# Altium project ResEnvAudioBoard.PrjPcb
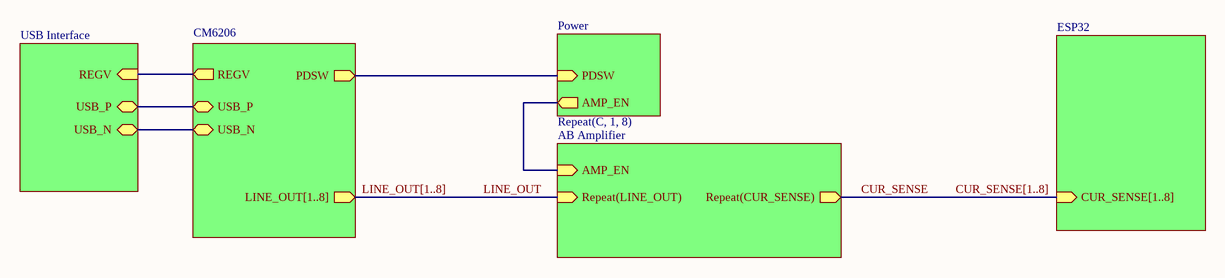
[diagram p0: Top Level.SchDoc]
6 sheets, 193 parts. Net scope: hierarchical (ports join the sheet entries above them; power ports are global).
Board file: AudioPCB.PcbDoc
Sheets:
  Top Level.SchDoc
    USB = USB Interface.SchDoc
    CM6206 = CM6206.SchDoc
    Power = Power.SchDoc
    C1 = AB Amplifier.SchDoc
    C2 = AB Amplifier.SchDoc
    C3 = AB Amplifier.SchDoc
    C4 = AB Amplifier.SchDoc
    C5 = AB Amplifier.SchDoc
    C6 = AB Amplifier.SchDoc
    C7 = AB Amplifier.SchDoc
    C8 = AB Amplifier.SchDoc
    Designator = ESP32.SchDoc

## Sheet Top Level.SchDoc
size 431 x 279 mm; Organization: ORGANIZATION; Address1: ADDRESS 1; Address2: ADDRESS 2; Address3: ADDRESS 3; Address4: ADDRESS 4; Revision: -; SheetNumber: 1; SheetTotal: 5; ENG_APP_DATE: --/--/--; DSN_APP_DATE: --/--/--; CHK_APP_DATE: --/--/--

### Sub-sheets
CM6206 = CM6206: PDSW (out), USB_P (bidir), USB_N (bidir), REGV (out), LINE_OUT[1..8] (out)
Designator = ESP32: CUR_SENSE[1..8] (in)
Power = Power: PDSW (in), AMP_EN (out)
Repeat(C, 1, 8) = AB Amplifier: Repeat(LINE_OUT) (in), Repeat(CUR_SENSE) (out), AMP_EN (in)
USB = USB Interface: USB_N (bidir), USB_P (bidir), REGV (in)

### Nets
AMP_EN: sheet Power/AMP_EN, sheet Repeat(C, 1, 8)/AMP_EN
CUR_SENSE: sheet Repeat(C, 1, 8)/Repeat(CUR_SENSE)
LINE_OUT: sheet Repeat(C, 1, 8)/Repeat(LINE_OUT)
USB_N: sheet USB/USB_N, sheet CM6206/USB_N
USB_P: sheet USB/USB_P, sheet CM6206/USB_P
NetC19_2: sheet USB/REGV, sheet CM6206/REGV
NetQ1_1: sheet CM6206/PDSW, sheet Power/PDSW

### Buses and harness runs
bus CUR_SENSE[1..8] = sheet Designator/CUR_SENSE[1..8]
bus LINE_OUT[1..8] = sheet CM6206/LINE_OUT[1..8]

### Notes on the sheet
- DWG. NO.
- REV.
- SHT.
- THIS DOCUMENT AND THE DATA DISCLOSED HEREIN OR HEREWITH IS THE PROPERTY OF ALTIUM LIMITED AND MAY BE FREELY DISTRIBUTED IN WHOLE. NO RIGHTS ARE RESERVED OR EXPRESS OR IMPLIED WARANTEE GIVEN.
- REVISION
- DESCRIPTION
- DATE
- APPROVED
- ENG:
- APPROVALS
- PROJECT
- DSN:
- CHK:
- REFERENCE DOCUMENTS
- PROJECT REVISION:
- TITLE
- DOCUMENT REVISION:
- DESIGN ITEM:
- BOM:
- FAB DWG:
- PCB DWG:
- ASSY DWG:
- SCALE:
- SIZE
- B
- CAGE CODE
- FILE NAME
- DWG NO.
- SHEET
- OF
- REV

## Sheet USB Interface.SchDoc
size 431 x 279 mm; Organization: ORGANIZATION; Address1: ADDRESS 1; Address2: ADDRESS 2; Address3: ADDRESS 3; Address4: ADDRESS 4; Revision: -; SheetNumber: 4; SheetTotal: 6; ENG_APP_DATE: --/--/--; DSN_APP_DATE: --/--/--; CHK_APP_DATE: --/--/--
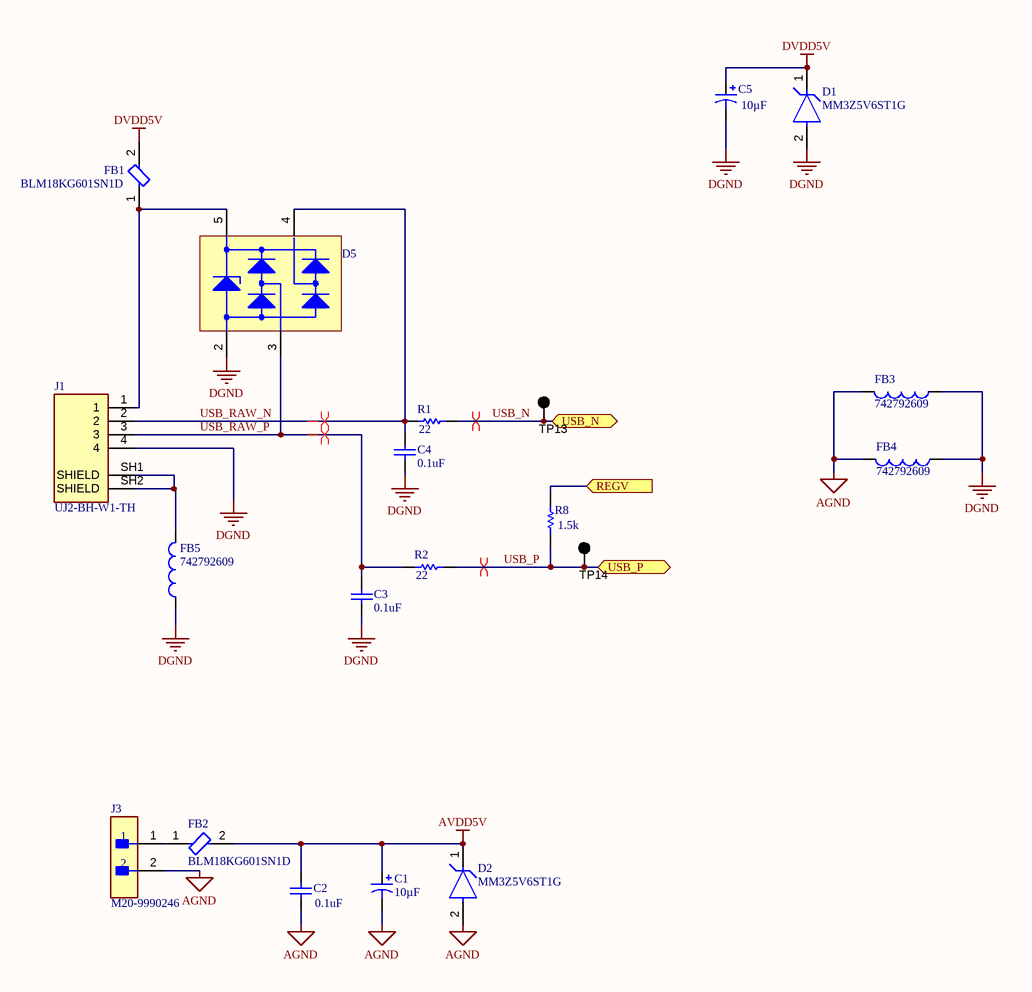
[diagram p1: USB Interface.SchDoc]

### Parts
C1  10µF  [1206 TANT CASE A]
C2  0.1uF  [0603]
C3  0.1uF  [0603]
C4  0.1uF  [0603]
C5  10µF  [1206 TANT CASE A]
D1  MM3Z5V6ST1G  [FP-477-02-MFG]
D2  MM3Z5V6ST1G  [FP-477-02-MFG]
D5  5V  [WE-TVS_SOT23-5L]  (value not drawn)
FB1  BLM18KG601SN1D  [FP-BLM18-0_15-t0_8-IPC_A]
FB2  BLM18KG601SN1D  [FP-BLM18-0_15-t0_8-IPC_A]
FB3  742792609  [WE-CBF_0603_L1.6W0.8H0.8_HC]
FB4  742792609  [WE-CBF_0603_L1.6W0.8H0.8_HC]
FB5  742792609  [WE-CBF_0603_L1.6W0.8H0.8_HC]
J1  UJ2-BH-W1-TH  [CUI_UJ2-BH-W1-TH]
J3  M20-9990246  [FP-M20-9990246-MFG]
R1  22  [0603]
R2  22  [0603]
R8  1.5k  [0603]
TP13  5001  [Testpoint pad]  (value not drawn)
TP14  5001  [Testpoint pad]  (value not drawn)

### Ports
REGV (in, see Top Level[7E], CM6206[7D]), USB_N (bidir, see Top Level[7E], CM6206[7D]), USB_P (bidir, see Top Level[7E], CM6206[7D])

### Nets
AGND: C1.1 C2.1 D2.2(A) FB3.2 FB4.2 J3.2
AVDD5V: C1.2 C2.2 D2.1(C) FB2.2
DGND: C3.1 C4.1 C5.1 D1.2(A) D5.2(GND) FB3.1 FB4.1 FB5.1 J1.4
DVDD5V: C5.2 D1.1(C) FB1.2
USB_N: R1.2 TP13.1 ; port USB_N
USB_P: R2.2 R8.2 TP14.1 ; port USB_P
USB_RAW_N: C4.2 D5.4(I/O_2) J1.2 R1.1
USB_RAW_P: C3.2 D5.3(I/O_1) J1.3 R2.1
NetC19_2: R8.1 ; port REGV
NetD5_5: D5.5(VDD) FB1.1 J1.1
NetFB2_1: FB2.1 J3.1
NetFB5_2: FB5.2 J1.SH1(SHIELD) J1.SH2(SHIELD)

### Layout directives
differential pair: USB_N, USB_P, USB_RAW_N, USB_RAW_P

### Notes on the sheet
- DWG. NO.
- REV.
- SHT.
- THIS DOCUMENT AND THE DATA DISCLOSED HEREIN OR HEREWITH IS THE PROPERTY OF ALTIUM LIMITED AND MAY BE FREELY DISTRIBUTED IN WHOLE. NO RIGHTS ARE RESERVED OR EXPRESS OR IMPLIED WARANTEE GIVEN.
- REVISION
- DESCRIPTION
- DATE
- APPROVED
- ENG:
- APPROVALS
- PROJECT
- DSN:
- CHK:
- REFERENCE DOCUMENTS
- PROJECT REVISION:
- TITLE
- DOCUMENT REVISION:
- DESIGN ITEM:
- BOM:
- FAB DWG:
- PCB DWG:
- ASSY DWG:
- SCALE:
- SIZE
- B
- CAGE CODE
- FILE NAME
- DWG NO.
- SHEET
- OF
- REV

### Library data of the parts
C1 C5 = T491A106M016AT: CAP TANT 10UF 16V 20% 1206; Manufacturer Size Code: A; Manufacturer: Kemet; ESR (Equivalent Series Resistance): 7 Ohm; Type: Molded; Lifetime @ Temp.: 2000 Hrs @ 85°C; Packaging: Cut Tape (CT); Capacitance: 10µF; Tolerance: ±20%; Voltage - Rated: 16V; Operating Temperature: -55°C ~ 125°C; Mounting Type: Surface Mount; Package / Case: 1206 (3216 Metric); Size / Dimension: 0.126" L x 0.063" W (3.20mm x 1.60mm); Height - Seated (Max): 0.071" (1.80mm); Lead Spacing: -; Features: General Purpose; ComponentLink1URL: http://www.kemet.com/Lists/ProductCatalog/Attachments/254/KEM_T2005_T491.pdf; ComponentLink1Description: http://www.kemet.com/Lists/ProductCatalog/Attachments/254/KEM_T2005_T491.pdf; Supplier 1: Digi-Key; Supplier Part Number 1: 399-3687-1-ND; Manufacturer Part Number: T491A106M016AT; RoHS: RoHS Compliant; Category: Capacitors; Stock: 136950; Pricing: 1=0.41, 10=0.362, 50=0.2198, 100=0.181, 250=0.14476, 500=0.13184, 1000=0.11891 (USD)
C2-C4 = C TBD 0603
D1 D2 = CMP-1060-00706-2: DIODE ZENER 5.6V 300MW SOD323; Test Current: 5mA; Power Rating: 200mW; ESD Protection: Yes; Peak Reverse Current: 1uA; Voltage Tolerance: 2%; Forward Voltage: 900mV; Impedance: 40R; Element Configuration: Single; Material: Plastic; Zener Current: 10mA; Length: 1.8mm; Package Quantity: 1; Contact Plating: Tin; Number of Pins: 2; Case/Package: SOD-323-2; Max Power Dissipation: 200mW; Lead Free: Lead Free; Radiation Hardening: No; Width: 1.35mm; REACH SVHC: No SVHC; Zener Voltage: 5.6V; Height: 1mm; Max Reverse Leakage Current: 1uA; Packaging: Tape and Reel; Min Operating Temperature: -65°C; Voltage Rating (DC): 5.6V; Power Dissipation: 200mW; Max Operating Temperature: 150°C; Working Voltage: 5.6V; Tolerance: 2%
D5 = 824011: WE-TVS TVS Diode – High Speed Series, SOT23-5L, 2+1 Channel, 5V, 2pF; Manufacturer: Wurth Elektronik; Channel ESD Clamping Voltage: 13V; Channel Reverse Leakage Current: 1uA; ESD Air Discharge Capability: 24kV; ESD Contact Discharge Capability: 16kV; Polarity: Unidirectional; (Reverse) Breakdown Voltage: 6.1V; (Reverse) Peak Pulse Current: 13A; Manufacturer Part Number: 824011; Category: ESD Protection; Match Code: WE-TVS; ComponentLink1Description: Website Link; ComponentLink1URL: https://www.we-online.com/redexpert/article/824011?ad; ComponentLink2Description: Datasheet Link; ComponentLink2URL: https://www.we-online.com/redexpert/spec/824011?ad; Mount: Surface Mount; Operating Temperature Max: 125°C; Operating Temperature Min: -55°C; Packaging: Tape and Reel; Case/Size Code: SOT23-5L; Length: 2.9mm; Width: 2.8mm; Height: 1.16mm; Channel Input Capacitance: 2pF; Channel Operating Voltage: 5V; Number of Channels: 2+1
FB1 FB2 = CMP-0686-00581-3: Chip Ferrite Bead, 0603, 600Ω @ 100MHz, 0.15Ω, 25%, 1.3A; Material: Steel; Number of Lines: 1; Impedance: 600R; DC Resistance (DCR): 150mR; Tolerance: 25%; Case Code (Metric): 1608; Width: 0.8mm; DC Current: 1.3A; Max DC Current: 1.3A; Package Quantity: 1; Number of Pins: 2; Military Standard: Not; RoHS Compliant: Yes; Termination: SMD/SMT; Max Operating Temperature: 125°C; Length: 1.6mm; Depth: 0.8mm; Case Code (Imperial): 0603; Series: BLM18K; Inductor Type: FERRITE BEAD; Core Material: Ferrite; Number of Circuits: 1; Height: 0.8mm; Case/Package: 0603; REACH SVHC: No SVHC; Packaging: Tape and Reel; Min Operating Temperature: -55°C; Max Current Rating: 1.3A; Radiation Hardening: No; Current Rating: 1.3A; Lead Free: Lead Free; Test Frequency: 100MHz; Weight: 7.1E-05oz
FB3-FB5 = CMP-0220-00193-3: NexarPartId: 8916973; Series Resistance: 40mΩ; RMS Current (Irms): 3A; Number of Lines: 1; Tolerance: 25%; Inductance: 5.6H; Test Frequency: 100MHz; Impedance: 30Ω; Max Operating Temperature: 125°C; Termination: SMD/SMT; Length: 1.6mm; Mount: Surface Mount; Case/Package: SMD/SMT; REACH SVHC: Unknown; Max DC Current: 3A; DC Resistance (DCR): 40mΩ; Resistance: 40mΩ; Min Operating Temperature: -55°C; Max Current Rating: 3A; Case Code (Metric): 1608; Width: 800µm; Material: Ferrite; Current Rating: 3A; Core Material: Ferrite; Packaging: Digi-Reel®; Height: 800µm; RoHS: Compliant; Depth: 800µm; Weight: 3.997283mg; Case Code (Imperial): 0603
J1 = UJ2-BH-W1-TH: 3 µin Plating Thickness, White Insulator, USB Receptacle; MF: {'manufacturer': u'CUI'}; Price: None; Value: *; Package: None; Availability: Unavailable; MP: UJ2-BH-W1-TH
J3 = CMP-15831-000009-1: CONN HEADER VERT 2POS 2.54MM; Manufacturer: Harwin; Conn Gender: Male; Conn Orientation: Vertical; Number Of Contacts: 2; Current Rating: 3A; ComponentLink2URL: https://cdn.harwin.com/pdfs/M20-999.pdf; ComponentLink2Description: Datasheet; Package: M20-9990246; Temperature: -40°C to +105°C; Octopart: https://octopart.com/m20-9990246-harwin-2590635; Mouser Description: 2.54mm (0.1") Pitch SIL Vertical PC Tail Pin Header, 6.1mm mating pin height, tin, 2 contacts; Temperature Range High: +105°C; Device Class L1: Connectors; RoHS: TRUE; Automotive: No; Height: 8.99mm; Number Of Rows: 1; Contact Material: Tin,Nickel; Category: Conn; Pitch: 2.54mm; Lead Free: Yes; Digikey Description: CONN HEADER VERT 2POS 2.54MM; Manufacturer Part Number: M20-9990246; Temperature Range Low: -40°C; Device Class L3: unset; Device Class L2: Headers and Wire Housings
R1 R2 R8 = R TBD 0603
TP13 TP14 = 5001: TEST POINT PC MINI .040"D BLACK; Manufacturer: Keystone Electronics; Packaging: Bulk; Type: PC Test Point, Miniature; Terminal: 0.010" x 0.020" (0.25mm x 0.51mm) Phosphor Bronze Wire, Silver Plated; Mounting Type: 0.040" (1.02mm) Hole Diameter; Material: Base, Nylon 46, UL 94V-0; Color: Black; ComponentLink1URL: http://www.keyelco.com/product-pdf.cfm?p=1310; ComponentLink1Description: http://www.keyelco.com/product-pdf.cfm?p=1310; Supplier 1: Digi-Key; Supplier Part Number 1: 36-5001-ND; Manufacturer Part Number: 5001; RoHS: RoHS Compliant; Category: Test and Measurement; Stock: 443864; Pricing: 1=0.36, 10=0.327, 50=0.238, 100=0.2286, 250=0.20528, 500=0.19594, 1000=0.16328, 2500=0.14928, 5000=0.13995 (USD)

## Sheet CM6206.SchDoc
size 431 x 279 mm; Organization: ORGANIZATION; Address1: ADDRESS 1; Address2: ADDRESS 2; Address3: ADDRESS 3; Address4: ADDRESS 4; Revision: -; SheetNumber: 3; SheetTotal: 6; ENG_APP_DATE: --/--/--; DSN_APP_DATE: --/--/--; CHK_APP_DATE: --/--/--
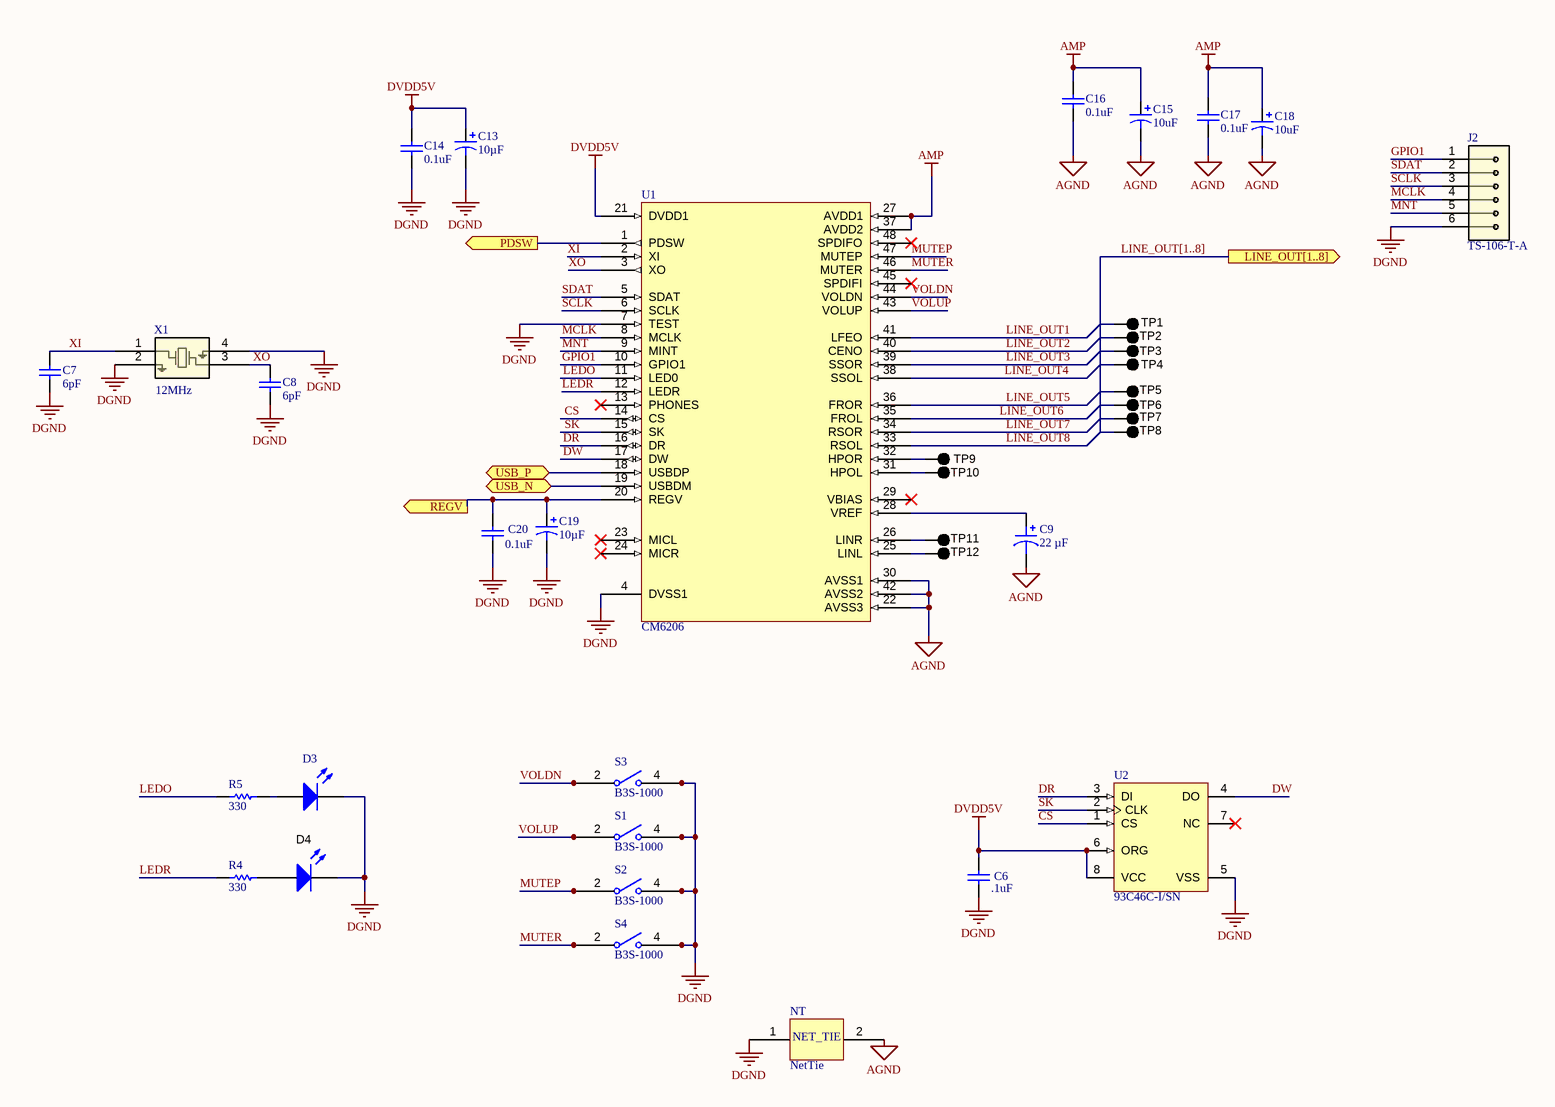
[diagram p2: CM6206.SchDoc]

### Parts
C6  .1uF  [0603]
C7  6pF  [0603]
C8  6pF  [0603]
C9  22 µF  [CAP POL 1411_3528]
C13  10µF  [1206 TANT CASE A]
C14  0.1uF  [0603]
C15  10uF  [1206 TANT CASE A]
C16  0.1uF  [0603]
C17  0.1uF  [0603]
C18  10uF  [1206 TANT CASE A]
C19  10µF  [1206 TANT CASE A]
C20  0.1uF  [0603]
D3  LTST-C190KGKT  [LED_LTST-C190]  (value not drawn)
D4  LB Q39G-L2OO-35-1  [LB Q39G_BLUE]  (value not drawn)
J2  TS-106-T-A  [CON6_1X6_TU_HTS_SAI]
NT  NetTie  [NetTie]  (net tie, no BOM)
R4  330  [0603]
R5  330  [0603]
S1  B3S-1000  [B3S-1000_OMR]
S2  B3S-1000  [B3S-1000_OMR]
S3  B3S-1000  [B3S-1000_OMR]
S4  B3S-1000  [B3S-1000_OMR]
TP1  5001  [Testpoint pad]  (value not drawn)
TP2  5001  [Testpoint pad]  (value not drawn)
TP3  5001  [Testpoint pad]  (value not drawn)
TP4  5001  [Testpoint pad]  (value not drawn)
TP5  5001  [Testpoint pad]  (value not drawn)
TP6  5001  [Testpoint pad]  (value not drawn)
TP7  5001  [Testpoint pad]  (value not drawn)
TP8  5001  [Testpoint pad]  (value not drawn)
TP9  5001  [Testpoint pad]  (value not drawn)
TP10  5001  [Testpoint pad]  (value not drawn)
TP11  5001  [Testpoint pad]  (value not drawn)
TP12  5001  [Testpoint pad]  (value not drawn)
U1  CM6206  [CM6206 LQFP48]
U2  93C46C-I/SN  [SOIC-SN8_N]
X1  ECS-120-8-36-CKM-TR3  [ECS-120-8_ECS]  (value not drawn)

### Ports
LINE_OUT[1..8] (out, see Top Level[6D]), PDSW (out, see Top Level[6E], Power[7E]), REGV (out, see Top Level[6E], USB Interface[5D]), USB_N (bidir, see Top Level[6E], USB Interface[5D]), USB_P (bidir, see Top Level[6E], USB Interface[5D])

### Nets
AGND: C9.2 C15.1 C16.1 C17.1 C18.1 NT.2 U1.22(AVSS3) U1.30(AVSS1) U1.42(AVSS2)
AMP: C15.2 C16.2 C17.2 C18.2 U1.27(AVDD1) U1.37(AVDD2)
DGND: C6.1 C7.1 C8.1 C13.1 C14.1 C19.1 C20.1 D3.2(K) D4.2(K) J2.6 NT.1 S1.3 S1.4 S2.3 S2.4 S3.3 S3.4 S4.3 S4.4 U1.4(DVSS1) U1.7(TEST) U2.5(VSS) X1.2 X1.4
DVDD5V: C6.2 C13.2 C14.2 U1.21(DVDD1) U2.6(ORG) U2.8(VCC)
CS: U1.14(CS) U2.1(CS)
DR: U1.16(DR) U2.3(DI)
DW: U1.17(DW) U2.4(DO)
GPIO1: J2.1 U1.10(GPIO1)
LEDO: R5.2 U1.11(LED0)
LEDR: R4.2 U1.12(LEDR)
LINE_OUT1: TP1.1 U1.41(LFEO)
LINE_OUT2: TP2.1 U1.40(CENO)
LINE_OUT3: TP3.1 U1.39(SSOR)
LINE_OUT4: TP4.1 U1.38(SSOL)
LINE_OUT5: TP5.1 U1.36(FROR)
LINE_OUT6: TP6.1 U1.35(FROL)
LINE_OUT7: TP7.1 U1.34(RSOR)
LINE_OUT8: TP8.1 U1.33(RSOL)
MCLK: J2.4 U1.8(MCLK)
MNT: J2.5 U1.9(MINT)
MUTEP: S2.1 S2.2 U1.47(MUTEP)
MUTER: S4.1 S4.2 U1.46(MUTER)
SCLK: J2.3 U1.6(SCLK)
SDAT: J2.2 U1.5(SDAT)
SK: U1.15(SK) U2.2(CLK)
USB_N: U1.19(USBDM) ; port USB_N
USB_P: U1.18(USBDP) ; port USB_P
VOLDN: S3.1 S3.2 U1.44(VOLDN)
VOLUP: S1.1 S1.2 U1.43(VOLUP)
XI: C7.2 U1.2(XI) X1.1
XO: C8.2 U1.3(XO) X1.3
NetC9_1: C9.1 U1.28(VREF)
NetC19_2: C19.2 C20.2 U1.20(REGV) ; port REGV
NetD3_1: D3.1(A) R5.1
NetD4_1: D4.1(A) R4.1
NetQ1_1: U1.1(PDSW) ; port PDSW
NetTP9_1: TP9.1 U1.32(HPOR)
NetTP10_1: TP10.1 U1.31(HPOL)
NetTP11_1: TP11.1 U1.26(LINR)
NetTP12_1: TP12.1 U1.25(LINL)

Not connected (* = marked no-connect by the designer): U1 13(PHONES)* 23(MICL)* 24(MICR)* 29(VBIAS)* 45(SPDIFI)* 48(SPDIFO)*; U2 7(NC)*

### Buses and harness runs
bus LINE_OUT[1..8] = port LINE_OUT[1..8]

### Notes on the sheet
- (near X1) 12MHz
- DWG. NO.
- REV.
- SHT.
- THIS DOCUMENT AND THE DATA DISCLOSED HEREIN OR HEREWITH IS THE PROPERTY OF ALTIUM LIMITED AND MAY BE FREELY DISTRIBUTED IN WHOLE. NO RIGHTS ARE RESERVED OR EXPRESS OR IMPLIED WARANTEE GIVEN.
- REVISION
- DESCRIPTION
- DATE
- APPROVED
- ENG:
- APPROVALS
- PROJECT
- DSN:
- CHK:
- REFERENCE DOCUMENTS
- PROJECT REVISION:
- TITLE
- DOCUMENT REVISION:
- DESIGN ITEM:
- BOM:
- FAB DWG:
- PCB DWG:
- ASSY DWG:
- SCALE:
- SIZE
- B
- CAGE CODE
- FILE NAME
- DWG NO.
- SHEET
- OF
- REV
- (in symbol NetTie) NET_TIE

### Library data of the parts
C6-C8 C14 C16 C17 C20 = C TBD 0603
C9 = T495B226K010ATE500: CAP TANT 22UF 10% 10V 1411; manufacturer: KEMET; Manufacturer Size Code: B; ESR (Equivalent Series Resistance): 500mOhm @ 100kHz; Lifetime @ Temp.: 2000 Hrs @ 125°C; Type: Molded; Part Number: T495B226K010ATE500; Value: 22 µF; Capacitance: 22 µF; componentlink1description: Datasheet; componentlink1url: https://api.kemet.com/component-edge/download/datasheet/T495B226K010ATE500.pdf; componentlink2description: DigiKey Link; componentlink2url: https://www.digikey.com/en/products/detail/kemet/T495B226K010ATE500/8763592; Device Package: 1411 (3528 Metric); Features: General Purpose; Height - Seated (Max): 0.083" (2.10mm); lastupdated: 6/3/2024 7:29:03 PM; Lifecycle Status: Active; Minimum Order: 1; Mounting Type: Surface Mount; Operating Temperature: -55°C ~ 125°C; Package / Case: 1411 (3528 Metric); packaging: TapeAndReel; partid: 6; Part Status: Active; price: 0.50; series: T495; Size / Dimension: 0.138" L x 0.110" W (3.50mm x 2.80mm); Supplier 1: DigiKey; Supplier Part Number 1: 399-18339-1-ND; Tolerance: ±10%; Voltage - Rated: 10 V
C13 C15 C18 C19 = T491A106M016AT: as C1 on sheet USB Interface; Packaging: Cut Tape (CT); Tolerance: ±20%; Voltage - Rated: 16V; Operating Temperature: -55°C ~ 125°C; Mounting Type: Surface Mount; Package / Case: 1206 (3216 Metric); Size / Dimension: 0.126" L x 0.063" W (3.20mm x 1.60mm); Height - Seated (Max): 0.071" (1.80mm); Lead Spacing: -; Features: General Purpose; ComponentLink1URL: http://www.kemet.com/Lists/ProductCatalog/Attachments/254/KEM_T2005_T491.pdf; ComponentLink1Description: http://www.kemet.com/Lists/ProductCatalog/Attachments/254/KEM_T2005_T491.pdf; Supplier 1: Digi-Key; Supplier Part Number 1: 399-3687-1-ND; Manufacturer Part Number: T491A106M016AT; RoHS: RoHS Compliant; Category: Capacitors; Stock: 136950; Pricing: 1=0.41, 10=0.362, 50=0.2198, 100=0.181, 250=0.14476, 500=0.13184, 1000=0.11891 (USD)
  C13 C19: Capacitance: 10µF
  C15 C18: Capacitance: 10uF
D3 = LTST-C190KGKT: LED GREEN CLEAR 0603 SMD; Manufacturer: Lite-On Inc.; Wavelength - Dominant: 571nm; Wavelength - Peak: 574nm; Millicandela Rating: 35mcd; Voltage - Forward (Vf) (Typ): 2V; Current - Test: 20mA; Viewing Angle: 130°; Lens Color: Colorless; Lens Style/Size: Rectangle with Flat Top, 1.10mm x 0.80mm; Packaging: Cut Tape (CT); Color: Green; Lens Transparency: Clear; Package / Case: 0603 (1608 Metric); Supplier Device Package: *; Size / Dimension: 1.60mm L x 0.80mm W; Height (Max): 0.80mm; Mounting Type: Surface Mount; ComponentLink1URL: http://optoelectronics.liteon.com/upload/download/DS22-2000-074/S_110_LTST-C190KGKT.pdf; ComponentLink1Description: http://optoelectronics.liteon.com/upload/download/DS22-2000-074/S_110_LTST-C190KGKT.pdf; Supplier 1: Digi-Key; Supplier Part Number 1: 160-1435-1-ND; Manufacturer Part Number: LTST-C190KGKT; RoHS: RoHS Compliant; Category: Optoelectronics; Stock: 632012; Pricing: 1=0.24, 10=0.186, 100=0.1015, 250=0.06768, 500=0.05752, 1000=0.04399 (USD); Supplier 2: Mouser; Supplier Part Number 2: 859-LTST-C190KGKT
D4 = LB Q39G-L2N2-35-1: LED BLUE DIFFUSED 0603 SMD; Manufacturer: OSRAM; Vf_V: 2.85; Value2: 2.85V; Io_A: 0.15; Tjmax_C: 95; Value1: W; U/M: EA; Wavelength - Dominant: 470nm; Wavelength - Peak: 472nm; Millicandela Rating: 29.5mcd; Current - Test: 5mA; Viewing Angle: 155°, 135°; Lens Color: White; Lens Style/Size: Rectangle with Flat Top, 1.10mm x 0.80mm; CompType: LED; PartNumber: LB Q39G-L2N2-35-1; SymbolVersion: 2008-12-08; MountType: SMT; RoHS: Y; PackageReference: BLUE 0603 LED; Type: ?; Published: 2008-07-11; Publisher: Texas Instruments; ComponentLink1URL: http://catalog.osram-os.com/catalogue/catalogue.do;jsessionid=8F4D5D14036503CDC6D844D9AC77EBC1?act=downloadFile&favOid=02000006000372cb000100b6; ComponentLink1Description: Datasheet link; LatestRevisionDate: 2015-04-28; Supplier 1: Digi-Key; Supplier Part Number 1: 475-2816-1-ND; Supplier 2: Mouser; Supplier Part Number 2: 720-LBQ39GL2N2351; Packaging: Cut Tape (CT); Voltage - Forward (Vf) (Typ): 2.85V; Lens Transparency: Diffused; Package / Case: 0603 (1608 Metric); Supplier Device Package: *; Size / Dimension: 1.60mm L x 0.80mm W; Height (Max): 0.40mm; Mounting Type: Surface Mount; ComponentLink2URL: http://media.digikey.com/pdf/Data%20Sheets/Osram%20PDFs/LB_LT%20Q39G.pdf; ComponentLink2Description: http://media.digikey.com/pdf/Data%20Sheets/Osram%20PDFs/LB_LT%20Q39G.pdf; Manufacturer Part Number: LB Q39G-L2OO-35-1; Category: Optoelectronics; Stock: 53859; Pricing: 1=0.38, 10=0.266, 25=0.2184, 100=0.1746, 250=0.13092, 500=0.11902, 1000=0.09522 (USD); Color: blue
J2 = TS-106-T-A: No Description Available; Mfr_Name: Samtec Inc; RefDes: RefDes; Type: Type
NT = NetTie: NET_TIE FOR EDGE
R4 R5 = R TBD 0603
TP1-TP12 = 5001: as TP13 on sheet USB Interface; Packaging: Bulk; Type: PC Test Point, Miniature; Terminal: 0.010" x 0.020" (0.25mm x 0.51mm) Phosphor Bronze Wire, Silver Plated; Mounting Type: 0.040" (1.02mm) Hole Diameter; Material: Base, Nylon 46, UL 94V-0; Color: Black; ComponentLink1URL: http://www.keyelco.com/product-pdf.cfm?p=1310; ComponentLink1Description: http://www.keyelco.com/product-pdf.cfm?p=1310; Supplier 1: Digi-Key; Supplier Part Number 1: 36-5001-ND; Manufacturer Part Number: 5001; RoHS: RoHS Compliant; Category: Test and Measurement; Stock: 443864; Pricing: 1=0.36, 10=0.327, 50=0.238, 100=0.2286, 250=0.20528, 500=0.19594, 1000=0.16328, 2500=0.14928, 5000=0.13995 (USD)
U2 = CMP-0162-00225-1: 1K, 128x8 or 64x16-bit, 5.0V Microwire Serial EEPROM, 8-Pin SOIC 150mil, Industrial Temperature; Code_JEDEC: MS-012; Code_IPC: SOIC127P600-8; PackageDescription: 8-Lead Plastic Small Outline (SN) - Narrow, 3.90mm Body [SOIC]; PackageReference: SOIC-SN8; PackageVersion: revBB, Aug-2009; DatasheetVersion: revG, May-2008
X1 = ECS-120-8-36-CKM-TR3: No Description Available; Mfr_Name: ECS International; Type: Crystals; RefDes: RefDes

## Sheet Power.SchDoc
size 431 x 279 mm; Organization: ORGANIZATION; Address1: ADDRESS 1; Address2: ADDRESS 2; Address3: ADDRESS 3; Address4: ADDRESS 4; Revision: -; SheetNumber: 5; SheetTotal: 6; ENG_APP_DATE: --/--/--; DSN_APP_DATE: --/--/--; CHK_APP_DATE: --/--/--
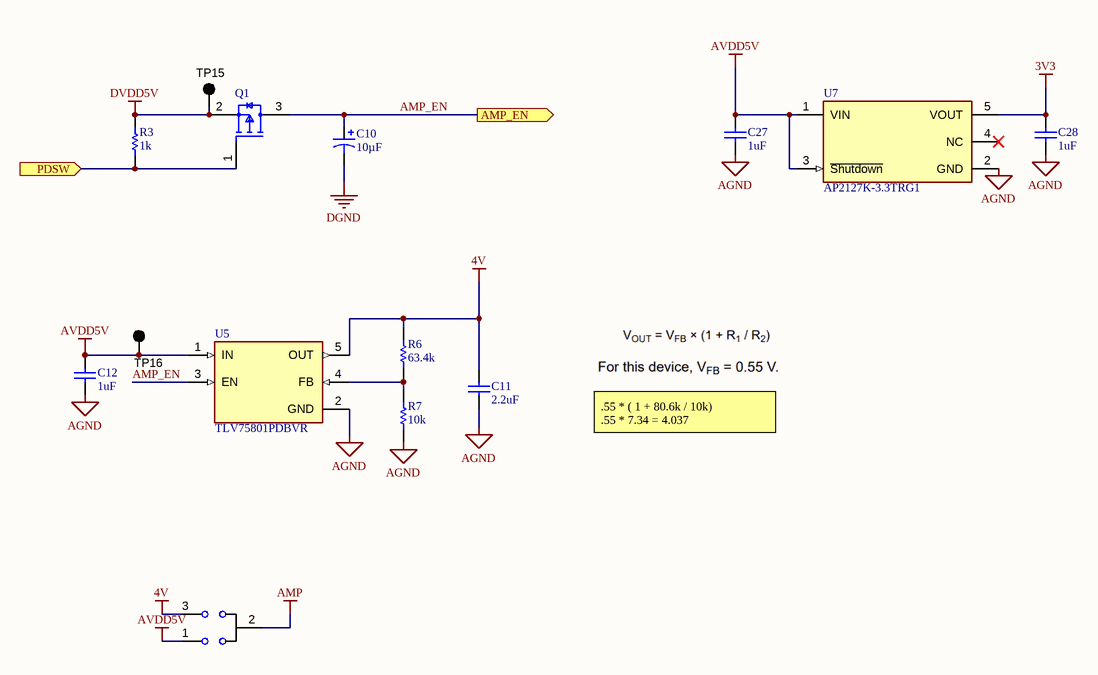
[diagram p3: Power.SchDoc]

### Parts
C10  10µF  [1206 TANT CASE A]
C11  2.2uF  [0603]
C12  1uF  [0603]
C27  1uF  [0603]
C28  1uF  [0603]
JP1  2 way jumper  [0603 2 way jumper]  (value not drawn)
Q1  DMG2301L-7  [FP-SOT23-MFG]  (value not drawn)
R3  1k  [0603]
R6  63.4k  [0603]
R7  10k  [0603]
TP15  5001  [Testpoint pad]  (value not drawn)
TP16  5001  [Testpoint pad]  (value not drawn)
U5  TLV75801PDBVR  [SOT95P280X145-5N]
U7  AP2127K-3.3TRG1  [FP-SOT25-MFG]

### Ports
AMP_EN (out, see Top Level[5E], AB Amplifier[6D]), PDSW (in, see Top Level[5E], CM6206[7E])

### Nets
3V3: C28.2 U7.5(VOUT)
4V: C11.2 JP1.3 R6.2 U5.5(OUT)
AGND: C11.1 C12.1 C27.1 C28.1 R7.1 U5.2(GND) U7.2(GND)
AMP: JP1.2
AVDD5V: C12.2 C27.2 JP1.1 TP16.1 U5.1(IN) U7.1(VIN) U7.3(~{Shutdown})
DGND: C10.1
DVDD5V: Q1.2(S) R3.2 TP15.1
AMP_EN: C10.2 Q1.3(D) U5.3(EN) ; port AMP_EN
NetQ1_1: Q1.1(G) R3.1 ; port PDSW
NetR6_1: R6.1 R7.2 U5.4(FB)

Not connected (* = marked no-connect by the designer): U7 4(NC)*

### Notes on the sheet
- .55 * ( 1 + 80.6k / 10k)
  .55 * 7.34 = 4.037
- DWG. NO.
- REV.
- SHT.
- THIS DOCUMENT AND THE DATA DISCLOSED HEREIN OR HEREWITH IS THE PROPERTY OF ALTIUM LIMITED AND MAY BE FREELY DISTRIBUTED IN WHOLE. NO RIGHTS ARE RESERVED OR EXPRESS OR IMPLIED WARANTEE GIVEN.
- REVISION
- DESCRIPTION
- DATE
- APPROVED
- ENG:
- APPROVALS
- PROJECT
- DSN:
- CHK:
- REFERENCE DOCUMENTS
- PROJECT REVISION:
- TITLE
- DOCUMENT REVISION:
- DESIGN ITEM:
- BOM:
- FAB DWG:
- PCB DWG:
- ASSY DWG:
- SCALE:
- SIZE
- B
- CAGE CODE
- FILE NAME
- DWG NO.
- SHEET
- OF
- REV

### Library data of the parts
C10 = T491A106M016AT: as C1 on sheet USB Interface; Packaging: Cut Tape (CT); Capacitance: 10µF; Tolerance: ±20%; Voltage - Rated: 16V; Operating Temperature: -55°C ~ 125°C; Mounting Type: Surface Mount; Package / Case: 1206 (3216 Metric); Size / Dimension: 0.126" L x 0.063" W (3.20mm x 1.60mm); Height - Seated (Max): 0.071" (1.80mm); Lead Spacing: -; Features: General Purpose; ComponentLink1URL: http://www.kemet.com/Lists/ProductCatalog/Attachments/254/KEM_T2005_T491.pdf; ComponentLink1Description: http://www.kemet.com/Lists/ProductCatalog/Attachments/254/KEM_T2005_T491.pdf; Supplier 1: Digi-Key; Supplier Part Number 1: 399-3687-1-ND; Manufacturer Part Number: T491A106M016AT; RoHS: RoHS Compliant; Category: Capacitors; Stock: 136950; Pricing: 1=0.41, 10=0.362, 50=0.2198, 100=0.181, 250=0.14476, 500=0.13184, 1000=0.11891 (USD)
C11 C12 C27 C28 = C TBD 0603
Q1 = CMP-12801-000065-1: MOSFET P-CH 20V 3A SOT23; Manufacturer: Diodes Inc.; Number Of Channels: 1; Turn On Delay Time: 5ns; Drain To Source Resistance: 120mΩ; Max Junction Temp: +150°C; Gate To Source Voltage: 8V; Power Dissipation: 1.5W; Rthja Max: 83°C/W; Max Forward Diode Voltage: -1.2V; Standoff Height: 0.013mm; Threshold Vgs Min: -0.4V; Input Capacitace At Vds: 476pF @ -10V; Depletion Mode: False; Gate Charge At Vgs: 5.5nC @ -4.5V; Pulse Drain Current: -10A; Drain To Source Voltage: -20V; Continuous Drain Current: -3A; Turn Off Delay Time: 30ns; Lead Free: Yes; Package: SOT23; ComponentLink2Description: Datasheet; Device Class L3: MOSFETs; Device Class L1: Discrete Semiconductors; Manufacturer Part Number: DMG2301L-7; Automotive: No; Height: 1.1mm; Category: Trans; Temperature Range High: +150°C; Digikey Description: MOSFET P-CH 20V 3A SOT23; RoHS: TRUE; Number Of P Channels: 1; Footprint Url: https://www.diodes.com/assets/Package-Files/SOT23.pdf; Octopart: https://octopart.com/dmg2301l-7-diodes+inc.-67250456; ComponentLink2URL: https://www.diodes.com/assets/Datasheets/DMG2301L.pdf; Mouser Description: Single P-Channel 20 V 1.5 W 5.5 nC Silicon Surface Mount Mosfet - SOT-23; Drain To Source Breakdown Voltage: -20V; Threshold Vgs Max: -1.2V; Device Class L2: Transistors; Temperature: -55°C to +150°C; Temperature Range Low: -55°C
R3 R6 R7 = R TBD 0603
TP15 TP16 = 5001: as TP13 on sheet USB Interface; Packaging: Bulk; Type: PC Test Point, Miniature; Terminal: 0.010" x 0.020" (0.25mm x 0.51mm) Phosphor Bronze Wire, Silver Plated; Mounting Type: 0.040" (1.02mm) Hole Diameter; Material: Base, Nylon 46, UL 94V-0; Color: Black; ComponentLink1URL: http://www.keyelco.com/product-pdf.cfm?p=1310; ComponentLink1Description: http://www.keyelco.com/product-pdf.cfm?p=1310; Supplier 1: Digi-Key; Supplier Part Number 1: 36-5001-ND; Manufacturer Part Number: 5001; RoHS: RoHS Compliant; Category: Test and Measurement; Stock: 443864; Pricing: 1=0.36, 10=0.327, 50=0.238, 100=0.2286, 250=0.20528, 500=0.19594, 1000=0.16328, 2500=0.14928, 5000=0.13995 (USD)
U5 = TLV75801PDBVR: 500-mA, low-IQ, high-accuracy, adjustable ultra-low-dropout voltage regulator with enable; MF: Texas Instruments; SnapEDA_Link: https://www.snapeda.com/parts/TLV75801PDBVR/Texas+Instruments/view-part/?ref=snap; Package: SOT-23-5 Texas Instruments; Value: *; MP: TLV75801PDBVR; Check_prices: https://www.snapeda.com/parts/TLV75801PDBVR/Texas+Instruments/view-part/?ref=eda
U7 = CMP-12756-000001-1: IC REG LINEAR 3.3V 300MA SOT23-5; Manufacturer: Diodes Inc.; Output Type: Fixed; Max Junction Temp: +150°C; Max Supply Voltage: 6V; Nominal Supply Current: 60uA; Standoff Height: 0.013mm; Min Supply Voltage: 2.5V; Dropout Voltage: 170mV; Number Of Outputs: 1; Accuracy Percentage: 2%; Output Current: 400mA; Temperature Range Low: -40°C; Octopart: https://octopart.com/ap2127k-3.3trg1-diodes+inc.-30954597; Automotive: No; Mouser Description: LDO Voltage Regulators 300mA CMOS LDO 2.5V to 6V; Device Class L3: Voltage Regulators - Linear; Height: 1.4mm; Ambient Temperature Range Low: -40°C; Output Voltage: 3.3V; ComponentLink2Description: Datasheet; RoHS: TRUE; Digikey Description: IC REG LINEAR 3.3V 300MA SOT23-5; Device Class L1: Integrated Circuits (ICs); Device Class L2: Power Management ICs; Footprint Url: https://www.diodes.com/assets/Package-Files/SOT25.pdf; Temperature: -40°C to +85°C; Category: IC; Lead Free: Yes; Temperature Range High: +85°C; Manufacturer Part Number: AP2127K-3.3TRG1; Ambient Temperature Range High: +85°C; Package: SOT25; ComponentLink2URL: https://www.diodes.com/assets/Datasheets/AP2127.pdf

## Sheet AB Amplifier.SchDoc
size 431 x 279 mm; Organization: ORGANIZATION; Address1: ADDRESS 1; Address2: ADDRESS 2; Address3: ADDRESS 3; Address4: ADDRESS 4; Revision: -; SheetNumber: 6; SheetTotal: 6; ENG_APP_DATE: --/--/--; DSN_APP_DATE: --/--/--; CHK_APP_DATE: --/--/--
Used 8 times, as channels C1, C2, C3, C4, C5, C6, C7, C8. Parts and nets are listed once, with the designators drawn on the sheet.
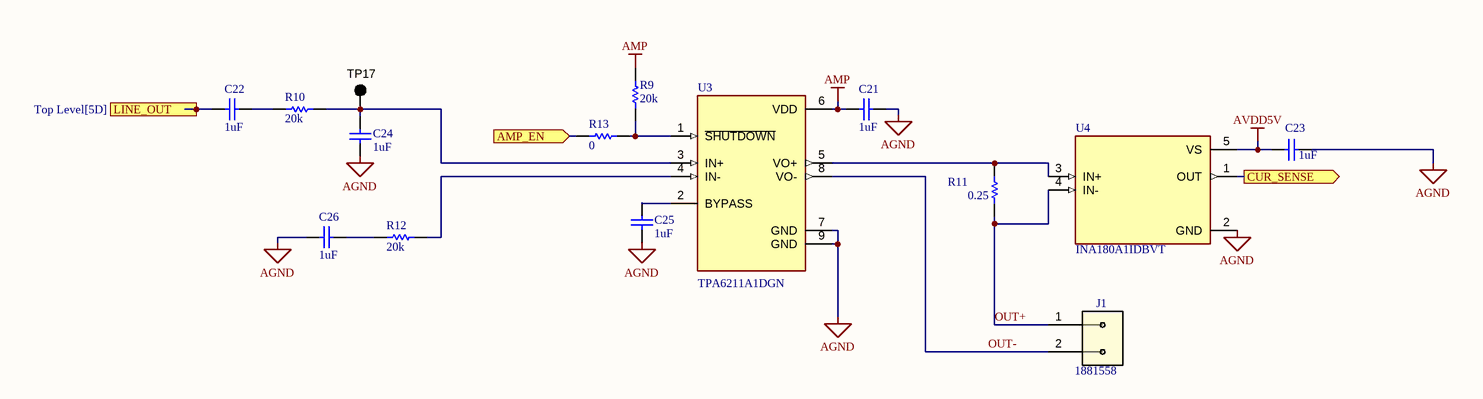
[diagram p4: AB Amplifier.SchDoc]

### Parts
C21  1uF  [0603]
C22  1uF  [0603]
C23  1uF  [0603]
C24  1uF  [0603]
C25  1uF  [0603]
C26  1uF  [0603]
J1  1881558  [1881558]
R9  20k  [0603]
R10  20k  [0603]
R11  0.25  [0805_HV]
R12  20k  [0603]
R13  0  [0603]
TP17  5001  [Testpoint pad]  (value not drawn)
U3  TPA6211A1DGN  [SOP65P490X110-9N]
U4  INA180A1IDBVT  [SOT95P280X145-5N]

### Ports
AMP_EN (in, see Top Level[5E], Power[5E]), CUR_SENSE (out, see Top Level[4D]), LINE_OUT (in, see Top Level[5D])

### Nets
AGND: C21.1 C23.1 C24.1 C25.1 C26.1 U3.7(GND) U3.9(GND) U4.2(GND)
AMP: C21.2 R9.2 U3.6(VDD)
AVDD5V: C23.2 U4.5(VS)
AMP_EN: R13.2 ; port AMP_EN
CUR_SENSE: U4.1(OUT) ; port CUR_SENSE
LINE_OUT: C22.1 ; port LINE_OUT
OUT+: J1.1 R11.1 U4.4(IN-)
OUT-: J1.2 U3.8(VO-)
NetC22_2: C22.2 R10.1
NetC24_2: C24.2 R10.2 TP17.1 U3.3(IN+)
NetC25_2: C25.2 U3.2(BYPASS)
NetC26_2: C26.2 R12.1
NetR9_1: R9.1 R13.1 U3.1(~{SHUTDOWN})
NetR11_2: R11.2 U3.5(VO+) U4.3(IN+)
NetR12_2: R12.2 U3.4(IN-)

### Channels
C1: designators end in _C1; ports AMP_EN=AMP_EN CUR_SENSE=CUR_SENSE1 LINE_OUT=LINE_OUT1
C2: designators end in _C2; ports AMP_EN=AMP_EN CUR_SENSE=CUR_SENSE2 LINE_OUT=LINE_OUT2
C3: designators end in _C3; ports AMP_EN=AMP_EN CUR_SENSE=CUR_SENSE3 LINE_OUT=LINE_OUT3
C4: designators end in _C4; ports AMP_EN=AMP_EN CUR_SENSE=CUR_SENSE4 LINE_OUT=LINE_OUT4
C5: designators end in _C5; ports AMP_EN=AMP_EN CUR_SENSE=CUR_SENSE5 LINE_OUT=LINE_OUT5
C6: designators end in _C6; ports AMP_EN=AMP_EN CUR_SENSE=CUR_SENSE6 LINE_OUT=LINE_OUT6
C7: designators end in _C7; ports AMP_EN=AMP_EN CUR_SENSE=CUR_SENSE7 LINE_OUT=LINE_OUT7
C8: designators end in _C8; ports AMP_EN=AMP_EN CUR_SENSE=CUR_SENSE8 LINE_OUT=LINE_OUT8

### Notes on the sheet
- DWG. NO.
- REV.
- SHT.
- THIS DOCUMENT AND THE DATA DISCLOSED HEREIN OR HEREWITH IS THE PROPERTY OF ALTIUM LIMITED AND MAY BE FREELY DISTRIBUTED IN WHOLE. NO RIGHTS ARE RESERVED OR EXPRESS OR IMPLIED WARANTEE GIVEN.
- REVISION
- DESCRIPTION
- DATE
- APPROVED
- ENG:
- APPROVALS
- PROJECT
- DSN:
- CHK:
- REFERENCE DOCUMENTS
- PROJECT REVISION:
- TITLE
- DOCUMENT REVISION:
- DESIGN ITEM:
- BOM:
- FAB DWG:
- PCB DWG:
- ASSY DWG:
- SCALE:
- SIZE
- B
- CAGE CODE
- FILE NAME
- DWG NO.
- SHEET
- OF
- REV

### Library data of the parts
C21-C26 = C TBD 0603
R9 R10 R12 R13 = R TBD 0603
R11 = R TBD 0805
TP17 = 5001: as TP13 on sheet USB Interface; Packaging: Bulk; Type: PC Test Point, Miniature; Terminal: 0.010" x 0.020" (0.25mm x 0.51mm) Phosphor Bronze Wire, Silver Plated; Mounting Type: 0.040" (1.02mm) Hole Diameter; Material: Base, Nylon 46, UL 94V-0; Color: Black; ComponentLink1URL: http://www.keyelco.com/product-pdf.cfm?p=1310; ComponentLink1Description: http://www.keyelco.com/product-pdf.cfm?p=1310; Supplier 1: Digi-Key; Supplier Part Number 1: 36-5001-ND; Manufacturer Part Number: 5001; RoHS: RoHS Compliant; Category: Test and Measurement; Stock: 443864; Pricing: 1=0.36, 10=0.327, 50=0.238, 100=0.2286, 250=0.20528, 500=0.19594, 1000=0.16328, 2500=0.14928, 5000=0.13995 (USD)
U3 = TPA6211A1DGN: 3.1-W, mono, analog input Class-AB audio amplifier; MF: Texas Instruments; SnapEDA_Link: https://www.snapeda.com/parts/TPA6211A1DGN/Texas+Instruments/view-part/?ref=snap; Package: HVSSOP-8 Texas Instruments; Value: *; MP: TPA6211A1DGN; Check_prices: https://www.snapeda.com/parts/TPA6211A1DGN/Texas+Instruments/view-part/?ref=eda
U4 = INA180A1IDBVT: 26V, 350kHz current sense amplifier; MF: Texas Instruments; MP: INA180A1IDBVT; Package: SOT-23-5 Texas Instruments; Purchase-URL: https://pricing.snapeda.com/search/part/INA180A1IDBVT/?ref=eda; Check_prices: https://www.snapeda.com/parts/INA180A1IDBVT/Texas+Instruments/view-part/?ref=eda; SnapEDA_Link: https://www.snapeda.com/parts/INA180A1IDBVT/Texas+Instruments/view-part/?ref=snap; Price: None; Availability: In Stock; Value: *

## Sheet ESP32.SchDoc
size 431 x 279 mm; Organization: ORGANIZATION; Address1: ADDRESS 1; Address2: ADDRESS 2; Address3: ADDRESS 3; Address4: ADDRESS 4; Revision: -; SheetNumber: 2; SheetTotal: 6; ENG_APP_DATE: --/--/--; DSN_APP_DATE: --/--/--; CHK_APP_DATE: --/--/--
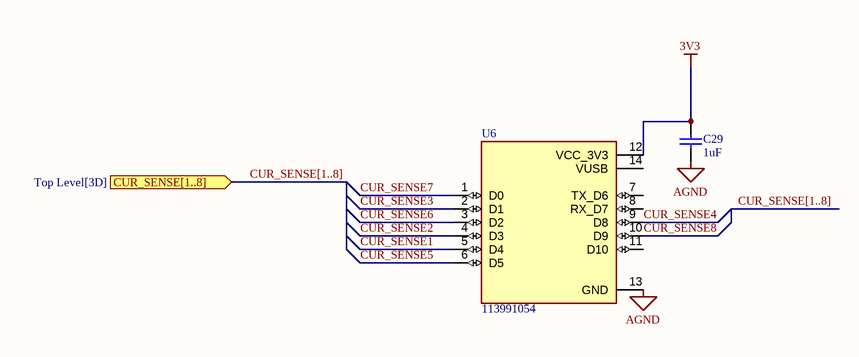
[diagram p5: ESP32.SchDoc]

### Parts
C29  1uF  [0603]
U6  113991054  [113991054]

### Ports
CUR_SENSE[1..8] (in, see Top Level[3D])

### Nets
3V3: C29.2 U6.12(VCC_3V3)
AGND: C29.1 U6.13(GND)
CUR_SENSE1: U6.5(D4)
CUR_SENSE2: U6.4(D3)
CUR_SENSE3: U6.2(D1)
CUR_SENSE4: U6.9(D8)
CUR_SENSE5: U6.6(D5)
CUR_SENSE6: U6.3(D2)
CUR_SENSE7: U6.1(D0)
CUR_SENSE8: U6.10(D9)

Not connected (* = marked no-connect by the designer): U6 7(TX_D6) 8(RX_D7) 11(D10) 14(VUSB)

### Buses and harness runs
bus CUR_SENSE[1..8]
bus CUR_SENSE[1..8] = port CUR_SENSE[1..8]

### Notes on the sheet
- DWG. NO.
- REV.
- SHT.
- THIS DOCUMENT AND THE DATA DISCLOSED HEREIN OR HEREWITH IS THE PROPERTY OF ALTIUM LIMITED AND MAY BE FREELY DISTRIBUTED IN WHOLE. NO RIGHTS ARE RESERVED OR EXPRESS OR IMPLIED WARANTEE GIVEN.
- REVISION
- DESCRIPTION
- DATE
- APPROVED
- ENG:
- APPROVALS
- PROJECT
- DSN:
- CHK:
- REFERENCE DOCUMENTS
- PROJECT REVISION:
- TITLE
- DOCUMENT REVISION:
- DESIGN ITEM:
- BOM:
- FAB DWG:
- PCB DWG:
- ASSY DWG:
- SCALE:
- SIZE
- B
- CAGE CODE
- FILE NAME
- DWG NO.
- SHEET
- OF
- REV

### Library data of the parts
C29 = C TBD 0603
U6 = 113991054: - ESP32-C3 Transceiver; 802.11 a/b/g/n (Wi-Fi, WiFi, WLAN), BluetoothÂ® Smart 4.x Low Energy (BLE) 2.4GHz Evaluation Board; MF: Seeed Technology Co., Ltd; Price: None; Availability: In Stock; Package: None; Check_prices: https://www.snapeda.com/parts/113991054/Seeed+Technology+Co.%252C+Ltd/view-part/?ref=eda; MP: 113991054; Value: *; SnapEDA_Link: https://www.snapeda.com/parts/113991054/Seeed+Technology+Co.%252C+Ltd/view-part/?ref=snap; Purchase-URL: https://pricing.snapeda.com/search/part/113991054/?ref=eda

## Nets that join several sheets
3V3: Power (C28.2 U7.5), ESP32 (C29.2 U6.12)
AGND: USB Interface (6 pins), CM6206 (9 pins), Power (7 pins), C1 (8 pins), C2 (8 pins), C3 (8 pins), C4 (8 pins), C5 (8 pins), C6 (8 pins), C7 (8 pins), C8 (8 pins), ESP32 (C29.1 U6.13)
AMP: CM6206 (6 pins), Power (JP1.2), C1 (C21_C1.2 R9_C1.2 U3_C1.6), C2 (C21_C2.2 R9_C2.2 U3_C2.6), C3 (C21_C3.2 R9_C3.2 U3_C3.6), C4 (C21_C4.2 R9_C4.2 U3_C4.6), C5 (C21_C5.2 R9_C5.2 U3_C5.6), C6 (C21_C6.2 R9_C6.2 U3_C6.6), C7 (C21_C7.2 R9_C7.2 U3_C7.6), C8 (C21_C8.2 R9_C8.2 U3_C8.6)
AVDD5V: USB Interface (C1.2 C2.2 D2.1 FB2.2), Power (7 pins), C1 (C23_C1.2 U4_C1.5), C2 (C23_C2.2 U4_C2.5), C3 (C23_C3.2 U4_C3.5), C4 (C23_C4.2 U4_C4.5), C5 (C23_C5.2 U4_C5.5), C6 (C23_C6.2 U4_C6.5), C7 (C23_C7.2 U4_C7.5), C8 (C23_C8.2 U4_C8.5)
DGND: USB Interface (9 pins), CM6206 (24 pins), Power (C10.1)
DVDD5V: USB Interface (C5.2 D1.1 FB1.2), CM6206 (6 pins), Power (Q1.2 R3.2 TP15.1)
AMP_EN: Power (C10.2 Q1.3 U5.3), C1 (R13_C1.2), C2 (R13_C2.2), C3 (R13_C3.2), C4 (R13_C4.2), C5 (R13_C5.2), C6 (R13_C6.2), C7 (R13_C7.2), C8 (R13_C8.2)
CUR_SENSE1: C1 (U4_C1.1), ESP32 (U6.5)
CUR_SENSE2: C2 (U4_C2.1), ESP32 (U6.4)
CUR_SENSE3: C3 (U4_C3.1), ESP32 (U6.2)
CUR_SENSE4: C4 (U4_C4.1), ESP32 (U6.9)
CUR_SENSE5: C5 (U4_C5.1), ESP32 (U6.6)
CUR_SENSE6: C6 (U4_C6.1), ESP32 (U6.3)
CUR_SENSE7: C7 (U4_C7.1), ESP32 (U6.1)
CUR_SENSE8: C8 (U4_C8.1), ESP32 (U6.10)
LINE_OUT1: CM6206 (TP1.1 U1.41), C1 (C22_C1.1)
LINE_OUT2: CM6206 (TP2.1 U1.40), C2 (C22_C2.1)
LINE_OUT3: CM6206 (TP3.1 U1.39), C3 (C22_C3.1)
LINE_OUT4: CM6206 (TP4.1 U1.38), C4 (C22_C4.1)
LINE_OUT5: CM6206 (TP5.1 U1.36), C5 (C22_C5.1)
LINE_OUT6: CM6206 (TP6.1 U1.35), C6 (C22_C6.1)
LINE_OUT7: CM6206 (TP7.1 U1.34), C7 (C22_C7.1)
LINE_OUT8: CM6206 (TP8.1 U1.33), C8 (C22_C8.1)
NetC19_2: USB Interface (R8.1), CM6206 (C19.2 C20.2 U1.20)
NetQ1_1: CM6206 (U1.1), Power (Q1.1 R3.1)
USB_N: USB Interface (R1.2 TP13.1), CM6206 (U1.19)
USB_P: USB Interface (R2.2 R8.2 TP14.1), CM6206 (U1.18)

## Assembly variants
No Pop CM6206 Board: not fitted J1 J1_C1 J1_C2 J1_C3 J1_C4 J1_C5 J1_C6 J1_C7 J1_C8 J2 J3 JP1 U1 U2 U6